# EAGLE schematic FMC (EAGLE 8.4.1)
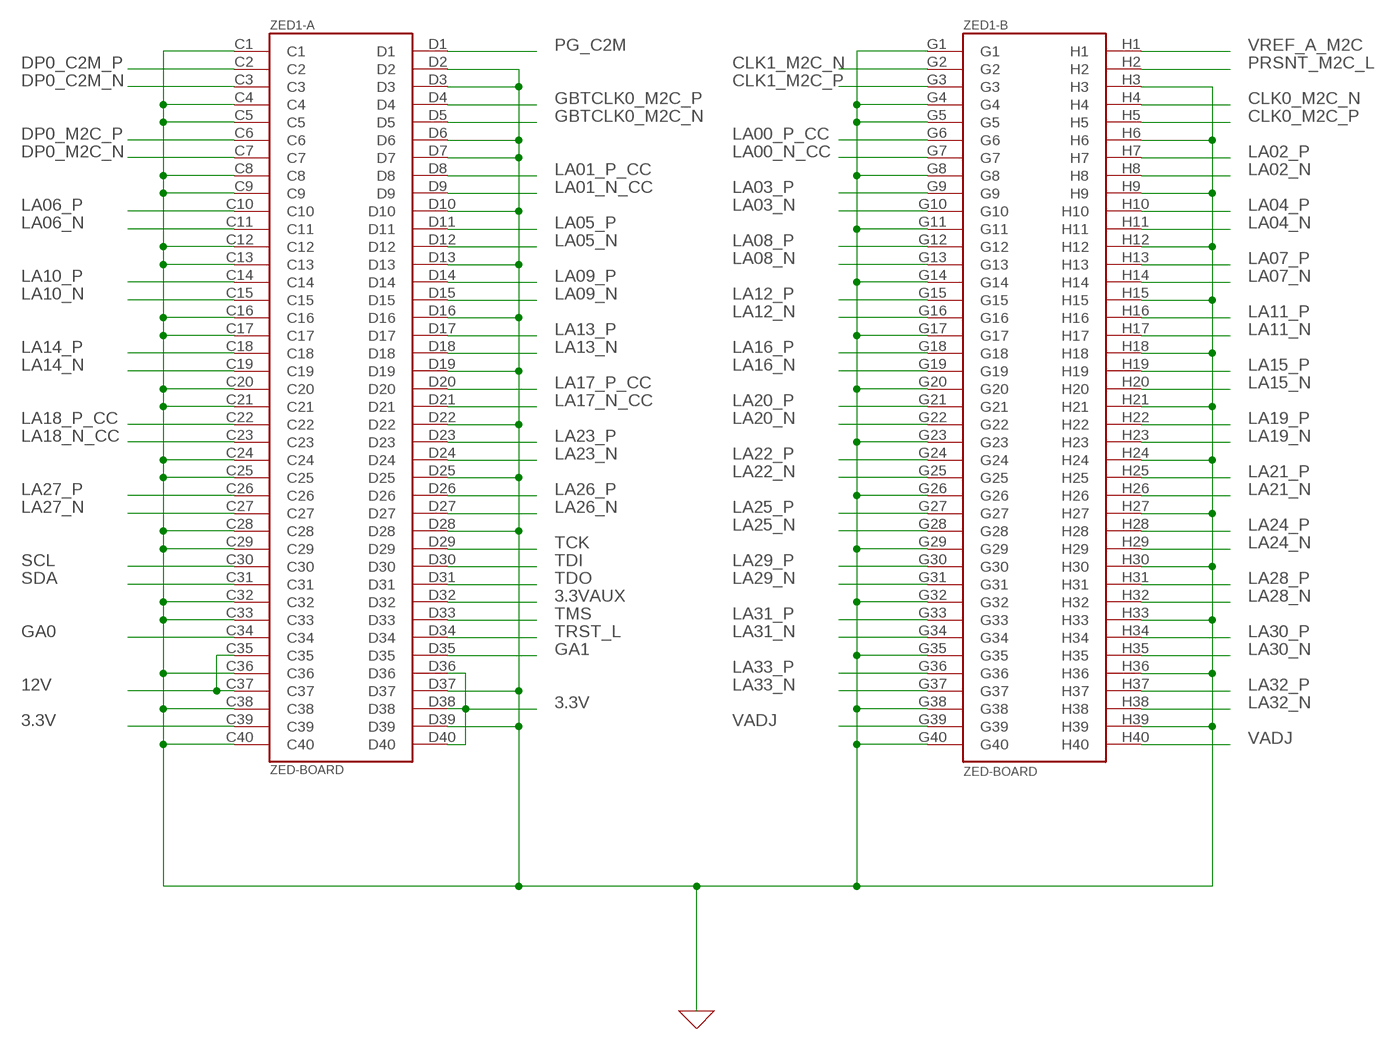
[diagram p0: schematic, sheet 1]

## Parts
ZED1  ZED-BOARD  [ASP-134604-01]

## Nets
0: ZED1.C1(-A:C1) ZED1.C4(-A:C4) ZED1.C5(-A:C5) ZED1.C8(-A:C8) ZED1.C9(-A:C9) ZED1.C12(-A:C12) ZED1.C13(-A:C13) ZED1.C16(-A:C16) ZED1.C17(-A:C17) ZED1.C20(-A:C20) ZED1.C21(-A:C21) ZED1.C24(-A:C24) ZED1.C25(-A:C25) ZED1.C28(-A:C28) ZED1.C29(-A:C29) ZED1.C32(-A:C32) ZED1.C33(-A:C33) ZED1.C36(-A:C36) ZED1.C38(-A:C38) ZED1.C40(-A:C40) ZED1.D2(-A:D2) ZED1.D3(-A:D3) ZED1.D6(-A:D6) ZED1.D7(-A:D7) ZED1.D10(-A:D10) ZED1.D13(-A:D13) ZED1.D16(-A:D16) ZED1.D19(-A:D19) ZED1.D22(-A:D22) ZED1.D25(-A:D25) ZED1.D28(-A:D28) ZED1.D37(-A:D37) ZED1.D39(-A:D39) ZED1.G1(-B:G1) ZED1.G4(-B:G4) ZED1.G5(-B:G5) ZED1.G8(-B:G8) ZED1.G11(-B:G11) ZED1.G14(-B:G14) ZED1.G17(-B:G17) ZED1.G20(-B:G20) ZED1.G23(-B:G23) ZED1.G26(-B:G26) ZED1.G29(-B:G29) ZED1.G32(-B:G32) ZED1.G35(-B:G35) ZED1.G38(-B:G38) ZED1.G40(-B:G40) ZED1.H3(-B:H3) ZED1.H6(-B:H6) ZED1.H9(-B:H9) ZED1.H12(-B:H12) ZED1.H15(-B:H15) ZED1.H18(-B:H18) ZED1.H21(-B:H21) ZED1.H24(-B:H24) ZED1.H27(-B:H27) ZED1.H30(-B:H30) ZED1.H33(-B:H33) ZED1.H36(-B:H36) ZED1.H39(-B:H39) ; supply symbol labelled GND
3.3V: ZED1.C39(-A:C39) ZED1.D36(-A:D36) ZED1.D38(-A:D38) ZED1.D40(-A:D40)
3.3VAUX: ZED1.D32(-A:D32)
12V: ZED1.C35(-A:C35) ZED1.C37(-A:C37)
CLK0_M2C_N: ZED1.H4(-B:H4)
CLK0_M2C_P: ZED1.H5(-B:H5)
CLK1_M2C_N: ZED1.G2(-B:G2)
CLK1_M2C_P: ZED1.G3(-B:G3)
DP0_C2M_N: ZED1.C3(-A:C3)
DP0_C2M_P: ZED1.C2(-A:C2)
DP0_M2C_N: ZED1.C7(-A:C7)
DP0_M2C_P: ZED1.C6(-A:C6)
GA0: ZED1.C34(-A:C34)
GA1: ZED1.D35(-A:D35)
GBTCLK0_M2C_N: ZED1.D5(-A:D5)
GBTCLK0_M2C_P: ZED1.D4(-A:D4)
LA00_N_CC: ZED1.G7(-B:G7)
LA00_P_CC: ZED1.G6(-B:G6)
LA01_N_CC: ZED1.D9(-A:D9)
LA01_P_CC: ZED1.D8(-A:D8)
LA02_N: ZED1.H8(-B:H8)
LA02_P: ZED1.H7(-B:H7)
LA03_N: ZED1.G10(-B:G10)
LA03_P: ZED1.G9(-B:G9)
LA04_N: ZED1.H11(-B:H11)
LA04_P: ZED1.H10(-B:H10)
LA05_N: ZED1.D12(-A:D12)
LA05_P: ZED1.D11(-A:D11)
LA06_N: ZED1.C11(-A:C11)
LA06_P: ZED1.C10(-A:C10)
LA07_N: ZED1.H14(-B:H14)
LA07_P: ZED1.H13(-B:H13)
LA08_N: ZED1.G13(-B:G13)
LA08_P: ZED1.G12(-B:G12)
LA09_N: ZED1.D15(-A:D15)
LA09_P: ZED1.D14(-A:D14)
LA10_N: ZED1.C15(-A:C15)
LA10_P: ZED1.C14(-A:C14)
LA11_N: ZED1.H17(-B:H17)
LA11_P: ZED1.H16(-B:H16)
LA12_N: ZED1.G16(-B:G16)
LA12_P: ZED1.G15(-B:G15)
LA13_N: ZED1.D18(-A:D18)
LA13_P: ZED1.D17(-A:D17)
LA14_N: ZED1.C19(-A:C19)
LA14_P: ZED1.C18(-A:C18)
LA15_N: ZED1.H20(-B:H20)
LA15_P: ZED1.H19(-B:H19)
LA16_N: ZED1.G19(-B:G19)
LA16_P: ZED1.G18(-B:G18)
LA17_N_CC: ZED1.D21(-A:D21)
LA17_P_CC: ZED1.D20(-A:D20)
LA18_N_CC: ZED1.C23(-A:C23)
LA18_P_CC: ZED1.C22(-A:C22)
LA19_N: ZED1.H23(-B:H23)
LA19_P: ZED1.H22(-B:H22)
LA20_N: ZED1.G22(-B:G22)
LA20_P: ZED1.G21(-B:G21)
LA21_N: ZED1.H26(-B:H26)
LA21_P: ZED1.H25(-B:H25)
LA22_N: ZED1.G25(-B:G25)
LA22_P: ZED1.G24(-B:G24)
LA23_N: ZED1.D24(-A:D24)
LA23_P: ZED1.D23(-A:D23)
LA24_N: ZED1.H29(-B:H29)
LA24_P: ZED1.H28(-B:H28)
LA25_N: ZED1.G28(-B:G28)
LA25_P: ZED1.G27(-B:G27)
LA26_N: ZED1.D27(-A:D27)
LA26_P: ZED1.D26(-A:D26)
LA27_N: ZED1.C27(-A:C27)
LA27_P: ZED1.C26(-A:C26)
LA28_N: ZED1.H32(-B:H32)
LA28_P: ZED1.H31(-B:H31)
LA29_N: ZED1.G31(-B:G31)
LA29_P: ZED1.G30(-B:G30)
LA30_N: ZED1.H35(-B:H35)
LA30_P: ZED1.H34(-B:H34)
LA31_N: ZED1.G34(-B:G34)
LA31_P: ZED1.G33(-B:G33)
LA32_N: ZED1.H38(-B:H38)
LA32_P: ZED1.H37(-B:H37)
LA33_N: ZED1.G37(-B:G37)
LA33_P: ZED1.G36(-B:G36)
PG_C2M: ZED1.D1(-A:D1)
PRSNT_M2C_L: ZED1.H2(-B:H2)
SCL: ZED1.C30(-A:C30)
SDA: ZED1.C31(-A:C31)
TCK: ZED1.D29(-A:D29)
TDI: ZED1.D30(-A:D30)
TDO: ZED1.D31(-A:D31)
TMS: ZED1.D33(-A:D33)
TRST_L: ZED1.D34(-A:D34)
VADJ: ZED1.G39(-B:G39) ZED1.H40(-B:H40)
VREF_A_M2C: ZED1.H1(-B:H1)

## Library data of the parts
ZED1 = zed-board:ZED-BOARD